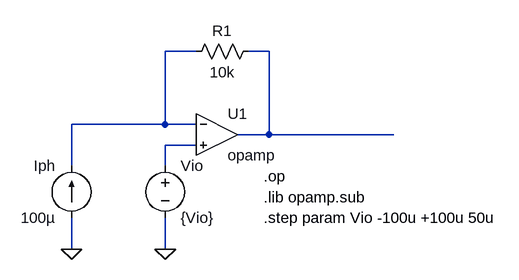
[diagram p0: schematic preamp-offset.asc]
preamp-offset.asc, the LTspice schematic file:
Version 4
SHEET 1 892 680
WIRE 416 144 368 144
WIRE 528 144 496 144
WIRE 368 256 368 144
WIRE 368 256 224 256
WIRE 416 256 368 256
WIRE 528 272 528 144
WIRE 528 272 480 272
WIRE 720 272 528 272
WIRE 416 288 368 288
WIRE 224 320 224 256
WIRE 368 320 368 288
WIRE 224 448 224 400
WIRE 368 448 368 400
FLAG 224 448 0
FLAG 368 448 0
SYMBOL /current 224 400 R180
WINDOW 0 24 80 Left 2
WINDOW 3 24 0 Left 2
SYMATTR InstName Iph
SYMATTR Value 100µ
SYMBOL /Opamps/opamp 448 208 R0
SYMATTR InstName U1
SYMBOL /voltage 368 304 R0
SYMATTR InstName Vio
SYMATTR Value {Vio}
SYMBOL /res 512 128 R90
WINDOW 0 0 56 VBottom 2
WINDOW 3 32 56 VTop 2
SYMATTR InstName R1
SYMATTR Value 10k
TEXT 520 368 Left 2 !.lib opamp.sub
TEXT 520 400 Left 2 !.step param Vio -100u +100u 50u
TEXT 520 336 Left 2 !.op

The netlist it stands for:
* preamp-offset.asc
Iph 0 N001 100µ
XU1 N001 N003 N002 opamp Aol=100K GBW=10Meg  ; pins invin noninvin out
Vio N003 0 {Vio}
R1 N002 N001 10k
.lib opamp.sub
.step param Vio -100u +100u 50u
.op
.backanno
.end